# EAGLE schematic Bottom (EAGLE 7.6.0)
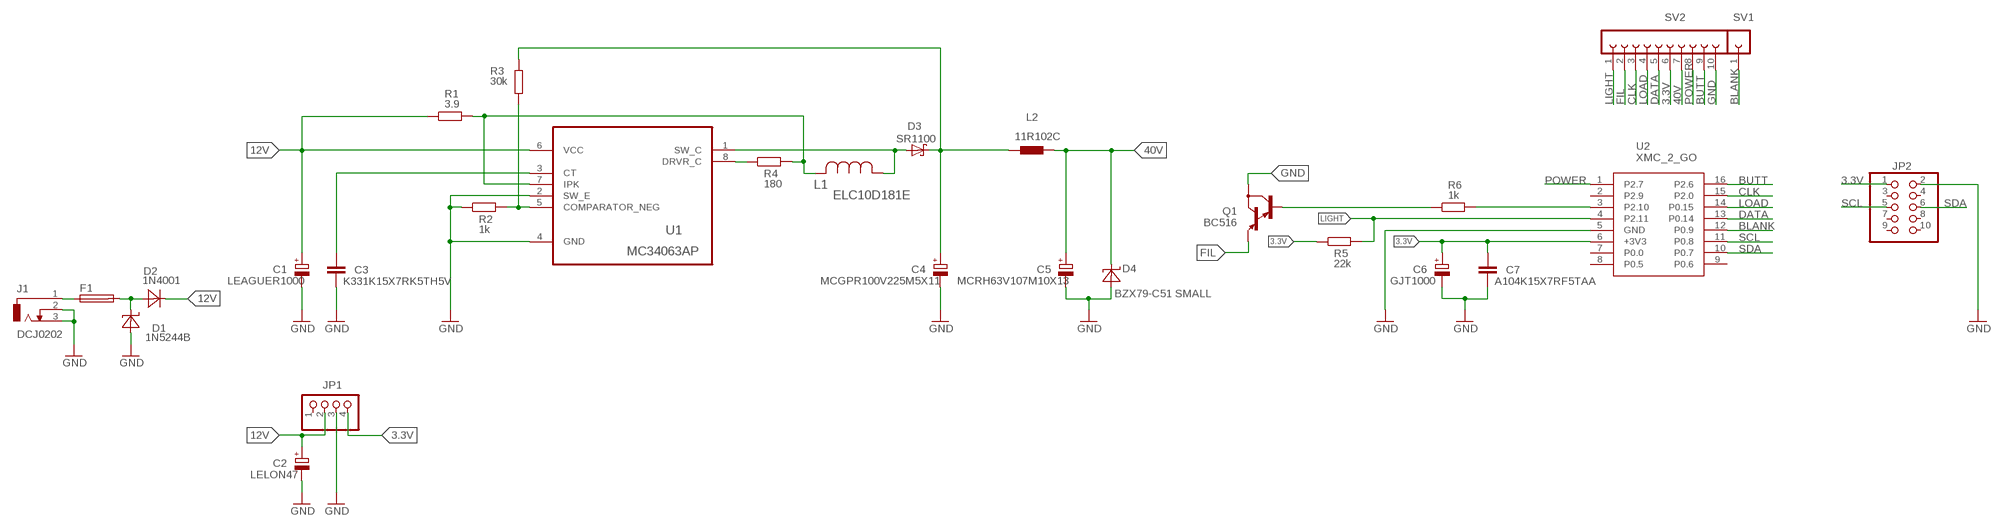
[diagram p0: schematic, sheet 1]

## Parts
C1  LEAGUER1000  [E5-10]
C2  LELON47  [E2,5-6]
C3  K331K15X7RK5TH5V  [C025-025X050]
C4  MCGPR100V225M5X11  [E2,5-5]
C5  MCRH63V107M10X13  [E5-10]
C6  GJT1000  [E2,5-8]
C7  A104K15X7RF5TAA  [C025-025X050]
D1  1N5244B  [DO41-7]
D2  1N4001  [DO41-7]
D3  SR1100  [DO41-7]
D4  BZX79-C51 SMALL  BZX79-C51  [DO35-7]
F1  SH22,5  [SH22,5]
J1  DCJ0202  [DCJ0202]
JP1  PINHD-1X4  [1X04]
JP2  PINHD-2X5/90  [2X05/90]
L1  ELC10D181E  ELC10D181E-10D  [IND_ELC10D]
L2  11R102C  [L2,5-5]
Q1  BC516  [TO92]
R1  3.9  R-EU_0207/10  [0207/10]
R2  1k  R-EU_0207/10  [0207/10]
R3  30k  R-EU_0207/10  [0207/10]
R4  180  R-EU_0207/10  [0207/10]
R5  22k  R-EU_0207/10  [0207/10]
R6  1k  R-EU_0207/10  [0207/10]
SV1  FE01  [FE05-1]
SV2  FE10-1  [FE10]
U1  MC34063AP  [DIP254P762X508-8]
U2  XMC_2_GO  [XMC_2_GO]

## Nets
3.3V: C6.+ C7.1 JP1.4 JP2.1 R5.1 SV2.6 U2.6(+3V3)
5V: L1.2 R1.2 R4.2 U1.7(IPK)
12V: C1.+ C2.+ D2.C JP1.2 R1.1 U1.6(VCC)
40V: C5.+ D4.C L2.2 SV2.7
BLANK: SV1.1 U2.12(P0.9)
BUTT: SV2.9 U2.16(P2.6)
CLK: SV2.3 U2.15(P2.0)
DATA: SV2.5 U2.13(P0.14)
FIL: Q1.1(E) SV2.2
GND: C1.- C2.- C3.2 C4.- C5.- C6.- C7.2 D1.A D4.A J1.2 J1.3 JP1.3 JP2.2 Q1.3(C) R2.1 SV2.10 U1.2(SW_E) U1.4(GND) U2.5(GND)
LIGHT: R5.2 SV2.1 U2.4(P2.11)
LOAD: SV2.4 U2.14(P0.15)
N$1: Q1.2(B) R6.1
N$2: R6.2 U2.3(P2.10)
N$3: F1.1 J1.1
N$6: C4.+ D3.C L2.1 R3.1
N$9: C3.1 U1.3(CT)
N$14: R2.2 R3.2 U1.5(COMPARATOR_NEG)
N$21: D3.A L1.1 U1.1(SW_C)
N$42: R4.1 U1.8(DRVR_C)
POW: D1.C D2.A F1.2
POWER: SV2.8 U2.1(P2.7)
SCL: JP2.5 U2.11(P0.8)
SDA: JP2.6 U2.10(P0.7)
Unconnected: JP1.1 JP2.3 JP2.4 JP2.7 JP2.8 JP2.9 JP2.10 U2.2(P2.9) U2.7(P0.0) U2.8(P0.5) U2.9(P0.6)

## Library data of the parts
C1 = MyLib:LEAGUER1000
C2 = MyLib:LELON47
C3 = MyLib:K331K15X7RK5TH5V
C4 = MyLib:MCGPR100V225M5X11
C5 = MyLib:MCRH63V107M10X13
C6 = MyLib:GJT1000
C7 = MyLib:A104K15X7RF5TAA
D1 = MyLib:1N5244B
D2 = MyLib:1N4001
D3 = MyLib:SR1100
D4 = MyLib:BZX79-C51
F1 = fuse:SH22,5: FUSE HOLDER grid 22,5 mm, OGN0031 8201, Schurter (Buerklin); MF: SCHURTER; MPN: 0031.8201; OC_FARNELL: 1162740; OC_NEWARK: 96F8317
J1 = con-jack:DCJ0202: DC POWER JACK Source: DCJ0202.pdf; OC_FARNELL: unknown; OC_NEWARK: unknown
JP1 = pinhead:PINHD-1X4: PIN HEADER
JP2 = pinhead:PINHD-2X5: PIN HEADER
L1 = Panasonic-ELC:ELC: Choke Coils; CURRENTRATING: 1.3A; MPN: ELC10D181E; OC_FARNELL: 1749071; OC_NEWARK: 32R9062; PACKAGE: Radial Lead-TH; SUPPLIER: PANASONIC; VALUE: 180UH
L2 = MyLib:11R102C
Q1 = transistor-pnp:BC516: PNP Darlington Transistor
R1-R6 = resistor:R-EU_: RESISTOR, European symbol
SV1 = MyLib:FE01: FEMALE HEADER; OC_FARNELL: unknown; OC_NEWARK: unknown
SV2 = con-lsta:FE10-1: FEMALE HEADER; OC_FARNELL: unknown; OC_NEWARK: unknown
U1 = MC34063:MC34063AP: REGULATORS; MPN: MC34063AP; OC_FARNELL: 1053579; OC_NEWARK: 04K3500; PACKAGE: PDIP-8; SUPPLIER: Texas Instruments
U2 = Line_Follower_LIBV3:XMC_2_GO